# EAGLE schematic pcb_1.0 (EAGLE 9.6.2)
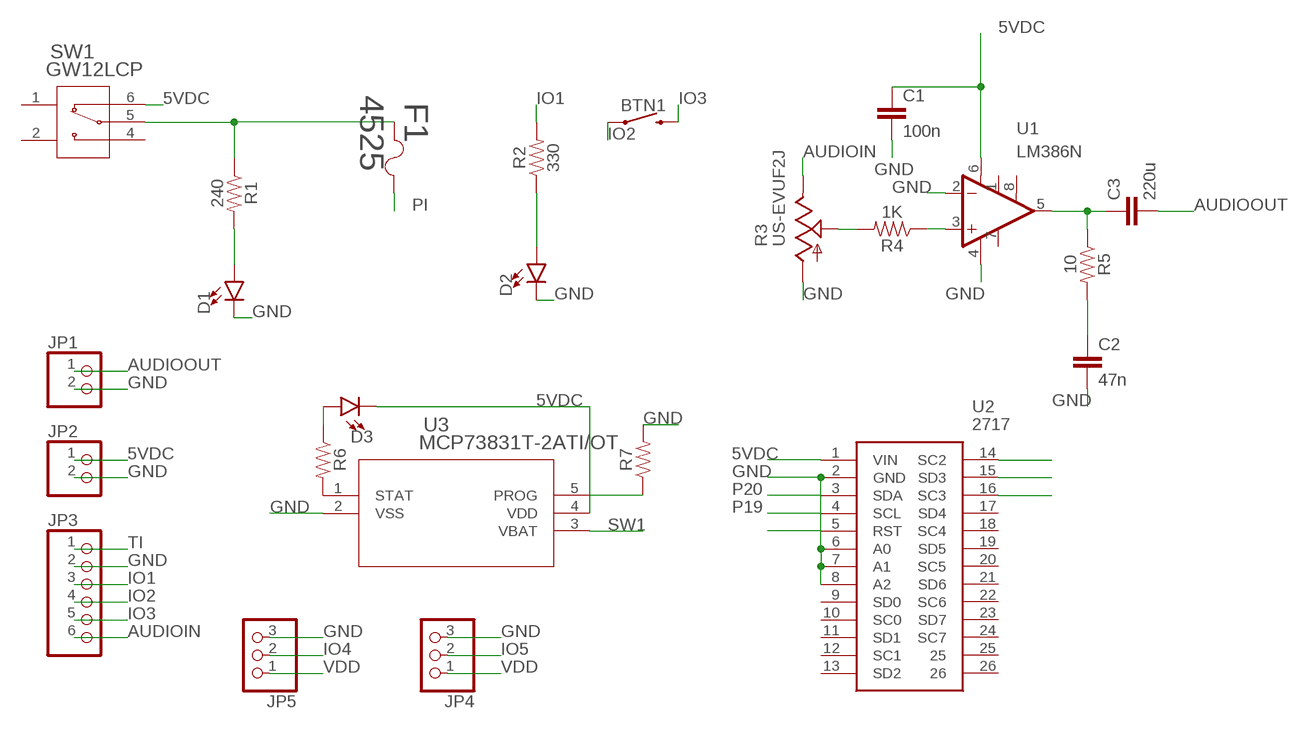
[diagram p0: schematic, sheet 1]

## Parts
BTN1  MOMENTARY-SWITCH-SPST-PTH-12MM  [TACTILE_SWITCH_PTH_12MM]
C1  100n  0.1UF-KIT-EZ-50V-20%  [CAP-PTH-SMALL-KIT]
C2  47n  0.1UF-KIT-EZ-50V-20%  [CAP-PTH-SMALL-KIT]
C3  220u  0.1UF-KIT-EZ-50V-20%  [CAP-PTH-SMALL-KIT]
D1  LED5MM  [LED_5MM]
D2  LED5MM  [LED_5MM]
D3  LED5MM  [LED_5MM]
F1  4525  [FUSE_4525_KEY]
JP1  PINHD-1X2  [1X02]
JP2  PINHD-1X2  [1X02]
JP3  PINHD-1X6  [1X06]
JP4  PINHD-1X3  [1X03]
JP5  PINHD-1X3  [1X03]
R1  240  1KOHM-HORIZ_KIT-1/4W-1%  [AXIAL-0.3-KIT]
R2  330  1KOHM-HORIZ_KIT-1/4W-1%  [AXIAL-0.3-KIT]
R3  US-EVUF2J  [EVUFXJ]
R4  1K  1KOHM-HORIZ_KIT-1/4W-1%  [AXIAL-0.3-KIT]
R5  10  1KOHM-HORIZ_KIT-1/4W-1%  [AXIAL-0.3-KIT]
R6  470  1KOHM-HORIZ_KIT-1/4W-1%  [AXIAL-0.3-KIT]
R7  470  1KOHM-HORIZ_KIT-1/4W-1%  [AXIAL-0.3-KIT]
SW1  GW12LCP  [GW12LCP_NKK]
U1  LM386N  LM386  [DIP08]
U2  2717  [2717]
U3  MCP73831T-2ATI/OT  [SOT-23-5_MC_MCH]

## Nets
5VDC: C1.1 D3.K(C) JP2.1 SW1.6 U1.6(V+) U2.1(VIN) U3.4(VDD)
AUDIOIN: JP3.6 R3.3(E)
AUDIOOUT: C3.2 JP1.1
GND: C1.2 C2.2 D1.K(C) D2.K(C) JP1.2 JP2.2 JP3.2 JP4.3 JP5.3 R3.1(A) R7.P$2 U1.2(-IN) U1.4(V-) U2.2(GND) U2.6(A0) U2.7(A1) U2.8(A2) U3.2(VSS)
IO1: JP3.3 R2.P$2
IO2: BTN1.1 JP3.4
IO3: BTN1.3 JP3.5
IO4: JP5.2
IO5: JP4.2
N$1: F1.1 R1.P$1 SW1.5
N$2: D1.A R1.P$2
N$3: D2.A R2.P$1
N$4: R3.2(S) R4.P$2
N$6: D3.A R6.P$1
N$7: C2.1 R5.P$2
N$8: C3.1 R5.P$1 U1.5(OUT)
N$9: R4.P$1 U1.3(+IN)
N$10: R6.P$2 U3.1(STAT)
N$11: U2.3(SDA)
N$12: U2.4(SCL)
N$13: U2.5(RST)
N$14: R7.P$1 U3.5(PROG)
P19: U2.16(SC3)
P20: U2.15(SD3)
PI: F1.2
SDATA0: U2.14(SC2)
SW1: U3.3(VBAT)
TI: JP3.1
VDD: JP4.1 JP5.1
Unconnected: SW1.1 SW1.2 SW1.4 U1.1(GAIN) U1.7(BP) U1.8(GAIN) U2.9(SD0) U2.10(SC0) U2.11(SD1) U2.12(SC1) U2.13(SD2) U2.17(SD4) U2.18(SC4) U2.19(SD5) U2.20(SC5) U2.21(SD6) U2.22(SC6) U2.23(SD7) U2.24(SC7) U2.25 U2.26

## Library data of the parts
BTN1 = SparkFun-Switches:MOMENTARY-SWITCH-SPST: Momentary Switch (Pushbutton) - SPST Normally-open (NO) SPST momentary switches (buttons, pushbuttons). Variants PTH-12MM - 12mm square, through-hole Momentary Pushbutton Switch - 12mm Square <https://www.sparkfun.com/products/9190> (COM-09190) PTH-6.0MM, PTH-6.0MM-KIT - 6.0mm square, through-hole Mini Pushbutton Switch <https://www.sparkfun.com/products/97> (COM-00097) KIT package intended for soldering kit's - only one side of pads' copper is exposed. PTH-RIGHT-ANGLE-KIT - Right-angle, through-hole Right Angle Tactile Button <https://www.sparkfun.com/products/10791> - Used on SparkFun BigTime Watch Kit <https://www.sparkfun.com/products/11734> SMD-12MM - 12mm square, surface-mount Tactile Button - SMD (12mm) <https://www.sparkfun.com/products/12993> (COM-12993) Used on SparkFun PicoBoard <https://www.sparkfun.com/products/11888> SMD-4.5MM - 4.5mm Square Trackball Switch Used on SparkFun Blackberry Trackballer Breakout <https://www.sparkfun.com/products/13169> SMD-4.6MMX2.8MM - 4.60mm x 2.80mm, surface mount Used on SparkFun SAMD21 Mini Breakout <https://www.sparkfun.com/products/13664> SMD-5.2MM, SMD-5.2-REDUNDANT - 5.2mm square, surface-mount Mini Pushbutton Switch - SMD <https://www.sparkfun.com/products/8720> (COM-08720) Used on Arduino Pro Mini <https://www.sparkfun.com/products/11114> REDUNDANT package connects both switch circuits together SMD-6.0X3.5MM - 6.0 x 3.5mm, surface mount Momentary Reset Switch SMD <https://www.sparkfun.com/products/8229> (COM-08229) SMD-6.2MM-TALL - 6.2mm square, surface mount Tactile Button - SMD (6mm) <https://www.sparkfun.com/products/12992> Used on SparkFun Digital Sandbox <https://www.sparkfun.com/products/12651> SMD-RIGHT-ANGLE - Right-angle, surface mount Used on SparkFun Block for Intel® Edison - Arduino <https://www.sparkfun.com/products/13036>; PROD_ID: SWCH-09185; SF_SKU: COM-09190
C1-C3 = SparkFun-Capacitors:0.1UF: 0.1µF ceramic capacitors A capacitor is a passive two-terminal electrical component used to store electrical energy temporarily in an electric field.; PROD_ID: CAP-08370; VALUE: 0.1uF
D1-D3 = SparkFun-LED:LED: LED (Generic) Standard schematic elements and footprints for 5mm, 3mm, 1206, and 0603 sized LEDs. Generic LEDs with no color specified.
F1 = 4525fuse:4525; COPYRIGHT: Copyright (C) 2022 Ultra Librarian. All rights reserved.; DIGI-KEY_PART_NUMBER_1: 36-4525-ND; DIGI-KEY_PART_NUMBER_2: 4525EB-ND; MANUFACTURER_PART_NUMBER: 4525; MFR_NAME: Keystone Electronics
JP1 JP2 = pinhead:PINHD-1X2: PIN HEADER
JP3 = pinhead:PINHD-1X6: PIN HEADER
JP4 JP5 = pinhead:PINHD-1X3: PIN HEADER
R1 R2 R4-R7 = SparkFun-Resistors:1KOHM: 1kΩ resistor A resistor is a passive two-terminal electrical component that implements electrical resistance as a circuit element. Resistors act to reduce current flow, and, at the same time, act to lower voltage levels within circuits. - Wikipedia; PROD_ID: RES-12182; VALUE: 1k
R3 = pot:US-EVU: 9 mm Square Rotary Potentiometers Source: Panasonic
SW1 = gw12lcpswitch:GW12LCP; COPYRIGHT: Copyright (C) 2022 Ultra Librarian. All rights reserved.; DIGI-KEY_PART_NUMBER_1: GW12LCP-ND; MANUFACTURER_PART_NUMBER: GW12LCP; MFR_NAME: NKK Switches
U1 = SparkFun-IC-Amplifiers:LM386: low voltage audio power amplifier SparkFun Products FabFM Radio Kit <https://www.sparkfun.com/products/11043> (KIT-11043); PROD_ID: IC-10899
U2 = TCA9548A_m:2717: Switch IC Development Tools TCA9548A I2C Multiplexer Source: Datasheet <https://learn.adafruit.com/downloads/pdf/adafruit-tca9548a-1-to-8-i2c-multiplexer-breakout.pdf>; DESCRIPTION: Switch IC Development Tools TCA9548A I2C Multiplexer; HEIGHT: 1mm; MANUFACTURER_NAME: Adafruit; MANUFACTURER_PART_NUMBER: 2717; MOUSER_PART_NUMBER: 485-2717; MOUSER_PRICE-STOCK: https://www.mouser.com/Search/Refine.aspx?Keyword=485-2717
U3 = mcp73831T-2ATI:MCP73831T-2ATI/OT; COPYRIGHT: Copyright (C) 2023 Ultra Librarian. All rights reserved.; MANUFACTURER_PART_NUMBER: MCP73831T-2ATI/OT; MFR_NAME: Microchip